# EAGLE design Lidar (EAGLE 9.6.2)

## Sheet 1 of 2
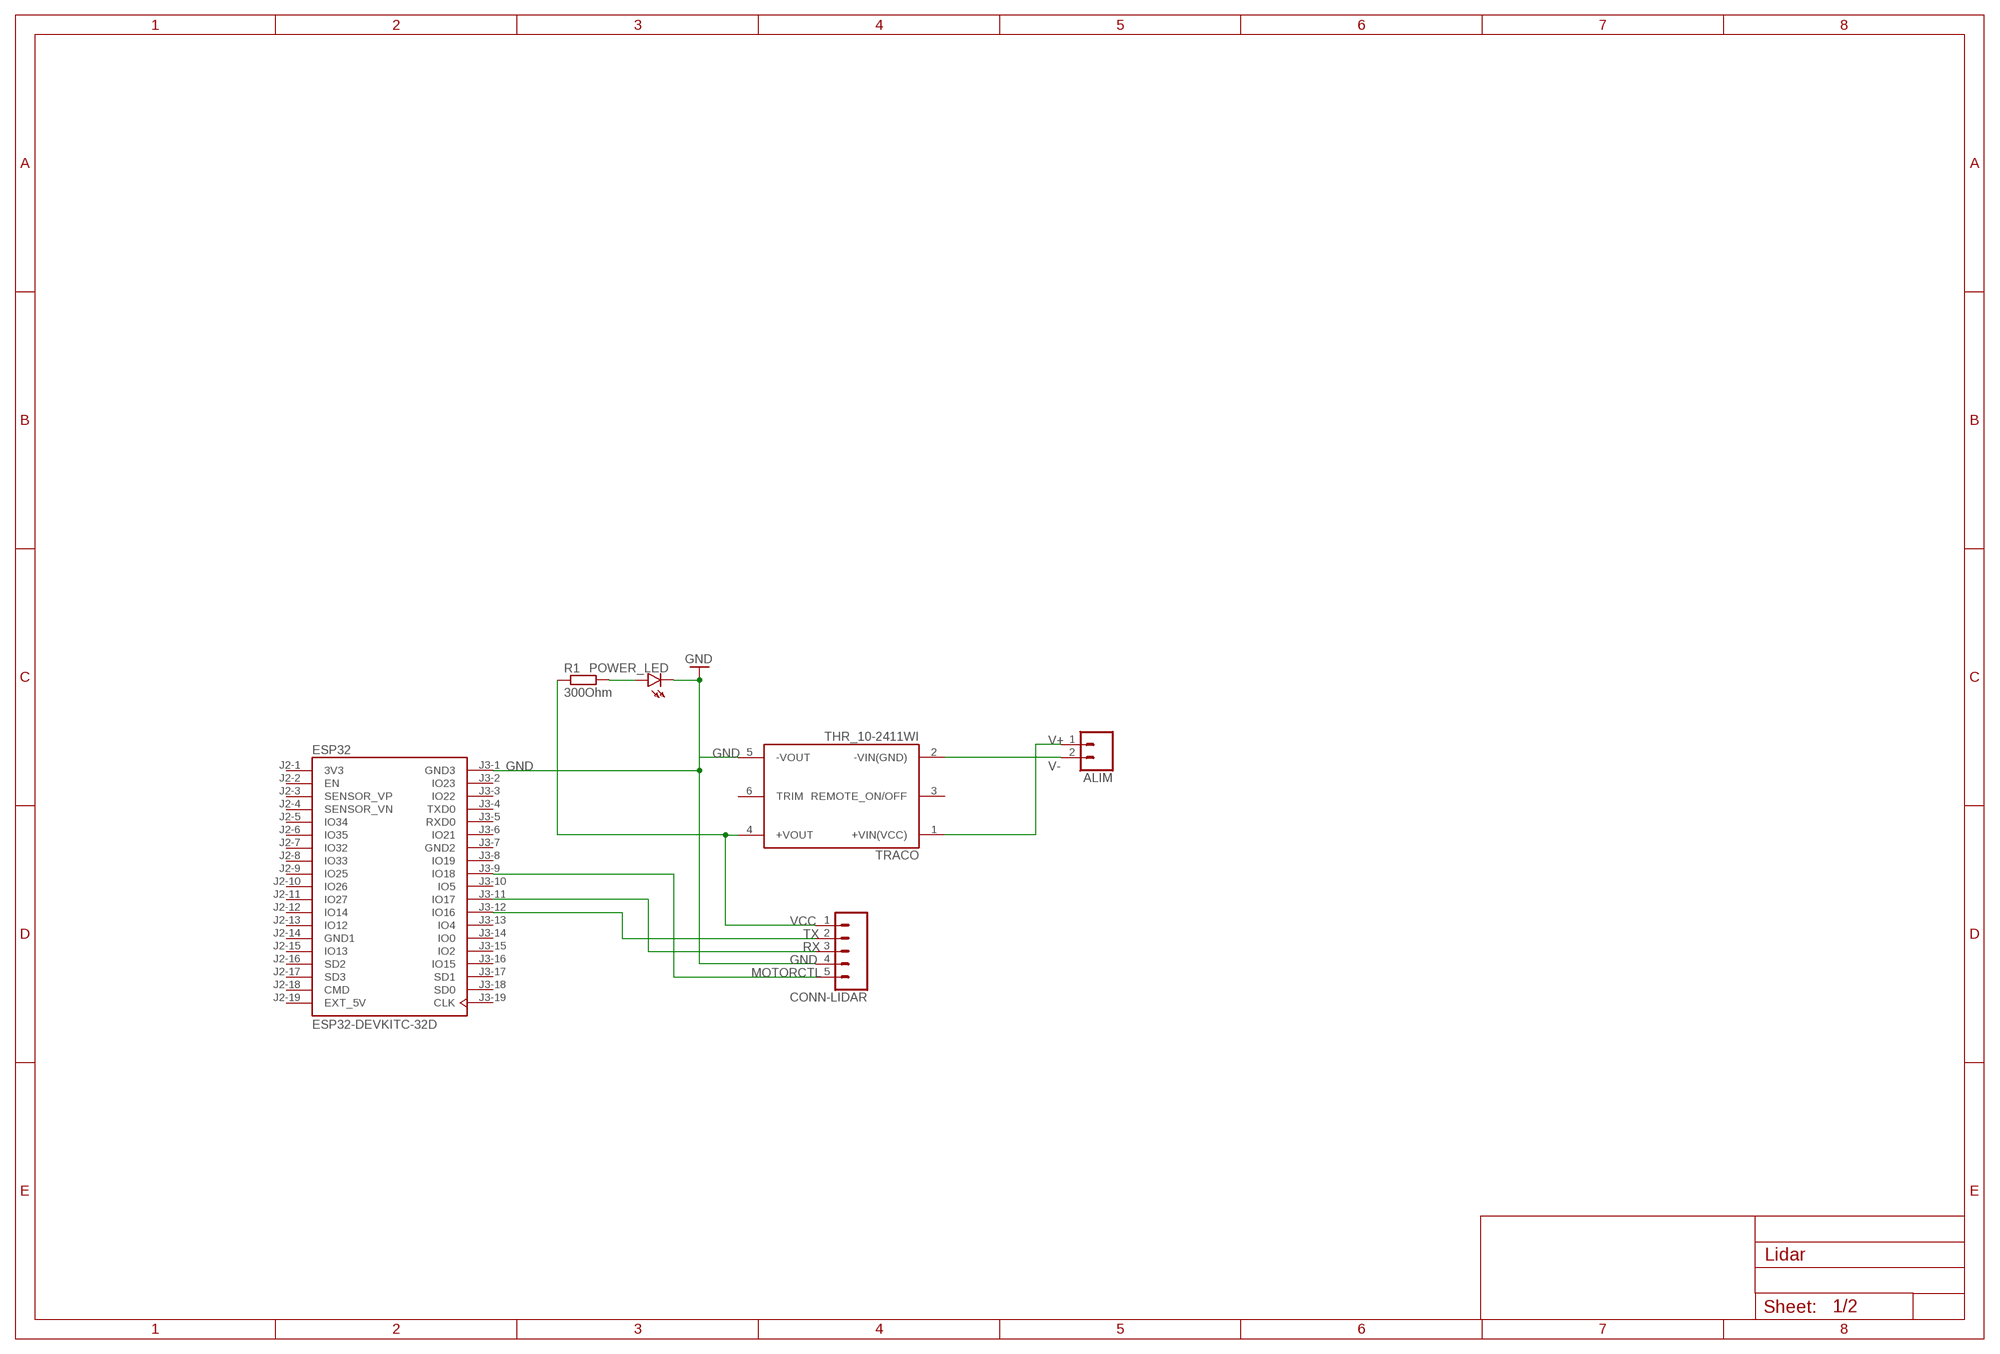
[diagram p0: schematic, sheet 1]

### Parts
ALIM  CONN_02POLAR  [MOLEX-1X2]
CONN-LIDAR  CONN_05PTH  [1X05]
ESP32  ESP32-DEVKITC-32D  [MODULE_ESP32-DEVKITC-32D]
POWER_LED  HLMP6  [HLMP6]
R1  300Ohm  R-EU_0411/15  [0411/15]
TRACO  THR_10-2411WI  [CONV_THR_10-2411WI]

### Nets
GND: CONN-LIDAR.4 ESP32.J3-1(GND3) POWER_LED.K TRACO.5(-VOUT)
MOTORCTL: CONN-LIDAR.5 ESP32.J3-9(IO18)
N$1: POWER_LED.A R1.2
RX: CONN-LIDAR.3 ESP32.J3-11(IO17)
TX: CONN-LIDAR.2 ESP32.J3-12(IO16)
V+: ALIM.1 TRACO.1(+VIN(VCC))
V-: ALIM.2 TRACO.2(-VIN(GND))
VCC: CONN-LIDAR.1 R1.1 TRACO.4(+VOUT)
Unconnected: ESP32.J2-2(EN) ESP32.J2-3(SENSOR_VP) ESP32.J2-4(SENSOR_VN) ESP32.J2-5(IO34) ESP32.J2-6(IO35) ESP32.J2-7(IO32) ESP32.J2-8(IO33) ESP32.J2-9(IO25) ESP32.J2-10(IO26) ESP32.J2-11(IO27) ESP32.J2-12(IO14) ESP32.J2-13(IO12) ESP32.J2-15(IO13) ESP32.J2-16(SD2) ESP32.J2-17(SD3) ESP32.J2-18(CMD) ESP32.J3-2(IO23) ESP32.J3-3(IO22) ESP32.J3-4(TXD0) ESP32.J3-5(RXD0) ESP32.J3-6(IO21) ESP32.J3-8(IO19) ESP32.J3-10(IO5) ESP32.J3-13(IO4) ESP32.J3-14(IO0) ESP32.J3-15(IO2) ESP32.J3-16(IO15) ESP32.J3-17(SD1) ESP32.J3-18(SD0) ESP32.J3-19(CLK) TRACO.3(REMOTE_ON/OFF) TRACO.6(TRIM)

## Sheet 2 of 2

## Power pins joined to a net without a drawn wire
3V3: ESP32.J2-1(3V3)
GND1: ESP32.J2-14(GND1)
GND2: ESP32.J3-7(GND2)
VCC: ESP32.J2-19(EXT_5V)

## Library data of the parts
ALIM = SparkFun-Connectors:CONN_02: Multi connection point. Often used as Generic Header-pin footprint for 0.1 inch spaced/style header connections On any of the 0.1 inch spaced packages, you can populate with these: Break Away Headers - Straight <https://www.sparkfun.com/products/116> (PRT-00116) Break Away Male Headers - Right Angle <https://www.sparkfun.com/products/553> (PRT-00553) Female Headers <https://www.sparkfun.com/products/115> (PRT-00115) Break Away Headers - Machine Pin <https://www.sparkfun.com/products/117> (PRT-00117) Break Away Female Headers - Swiss Machine Pin <https://www.sparkfun.com/products/743> (PRT-00743) For SCREWTERMINALS and SPRING TERMINALS visit here: Screw Terimnals on SparkFun.com <https://www.sparkfun.com/search/results?term=Screw+Terminals> (5mm/3.5mm/2.54mm spacing) This device is also useful as a general connection point to wire up your design to another part of your project. Our various solder wires solder well into these plated through hole pads. Hook-Up Wire - Assortment (Stranded, 22 AWG) <https://www.sparkfun.com/products/11375> (PRT-11375) Hook-Up Wire - Assortment (Solid Core, 22 AWG) <https://www.sparkfun.com/products/11367> (PRT-11367) View the entire wire category on our website here <https://www.sparkfun.com/categories/141> Special notes: Molex polarized connector foot print use with: PRT-08233 with associated crimp pins and housings. 2.54_SCREWTERM for use with PRT-10571. 3.5mm Screw Terminal footprints for PRT-08084 5mm Screw Terminal footprints for use with PRT-08432; SF_ID: PRT-09918
CONN-LIDAR = SparkFun-Connectors:CONN_05: Multi connection point. Often used as Generic Header-pin footprint for 0.1 inch spaced/style header connections On any of the 0.1 inch spaced packages, you can populate with these: Break Away Headers - Straight <https://www.sparkfun.com/products/116> (PRT-00116) Break Away Male Headers - Right Angle <https://www.sparkfun.com/products/553> (PRT-00553) Female Headers <https://www.sparkfun.com/products/115> (PRT-00115) Break Away Headers - Machine Pin <https://www.sparkfun.com/products/117> (PRT-00117) Break Away Female Headers - Swiss Machine Pin <https://www.sparkfun.com/products/743> (PRT-00743) For SCREWTERMINALS and SPRING TERMINALS visit here: Screw Terimnals on SparkFun.com <https://www.sparkfun.com/search/results?term=Screw+Terminals> (5mm/3.5mm/2.54mm spacing) This device is also useful as a general connection point to wire up your design to another part of your project. Our various solder wires solder well into these plated through hole pads. Hook-Up Wire - Assortment (Stranded, 22 AWG) <https://www.sparkfun.com/products/11375> (PRT-11375) Hook-Up Wire - Assortment (Solid Core, 22 AWG) <https://www.sparkfun.com/products/11367> (PRT-11367) View the entire wire category on our website here <https://www.sparkfun.com/categories/141> Special notes: Molex polarized connector foot print use with SKU : PRT-08231 with associated crimp pins and housings. 1MM SMD Version SKU: PRT-10208
ESP32 = ESP32-DEVKITC-32D:ESP32-DEVKITC-32D: Check availability <https://pricing.snapeda.com/parts/ESP32-DEVKITC-32D/Espressif%20Systems/view-part?ref=eda>; AVAILABILITY: In Stock; CHECK_PRICES: https://www.snapeda.com/parts/ESP32-DEVKITC-32D/Espressif+Systems/view-part/?ref=eda; DESCRIPTION: WiFi Development Tools (802.11) ESP32 General Development Kit, ESP32-WROOM-32D on the board; MF: Espressif Systems; MP: ESP32-DEVKITC-32D; PACKAGE: None; PRICE: None; PURCHASE-URL: https://www.snapeda.com/api/url_track_click_mouser/?unipart_id=2777395&manufacturer=Espressif Systems&part_name=ESP32-DEVKITC-32D&search_term=esp32-devkitc-32d; SNAPEDA_LINK: https://www.snapeda.com/parts/ESP32-DEVKITC-32D/Espressif+Systems/view-part/?ref=snap
POWER_LED = display-hp:HLMP6: LED 2mm horizontal; MF: AGILENT TECHNOLOGIES; MPN: HLMP-6500; OC_FARNELL: 1652490; OC_NEWARK: 40K0088
R1 = rcl:R-EU_: RESISTOR, European symbol; SPICEPREFIX: R
TRACO = THR_10-2411WI:THR_10-2411WI: 10 Watt DC/DC converter, industrial, 4:1 input, reinforced isolation (3000 VAC), encapsulated, 2"x1" Check availability <https://pricing.snapeda.com/parts/THR%2010-2411WI/Traco%20Power/view-part?ref=eda>; AVAILABILITY: In Stock; DESCRIPTION: 10 Watt DC/DC converter, industrial, 4:1 input, reinforced isolation (3000 VAC), encapsulated, 2x1; MF: Traco Power; MP: THR 10-2411WI; PACKAGE: DIP-6 Traco Power; PRICE: None; PURCHASE-URL: https://pricing.snapeda.com/search/part/THR 10-2411WI/?ref=eda

## Net classes
0 default: width 0.813 mm, drill 0.102 mm, clearance 0.102 mm

## Board
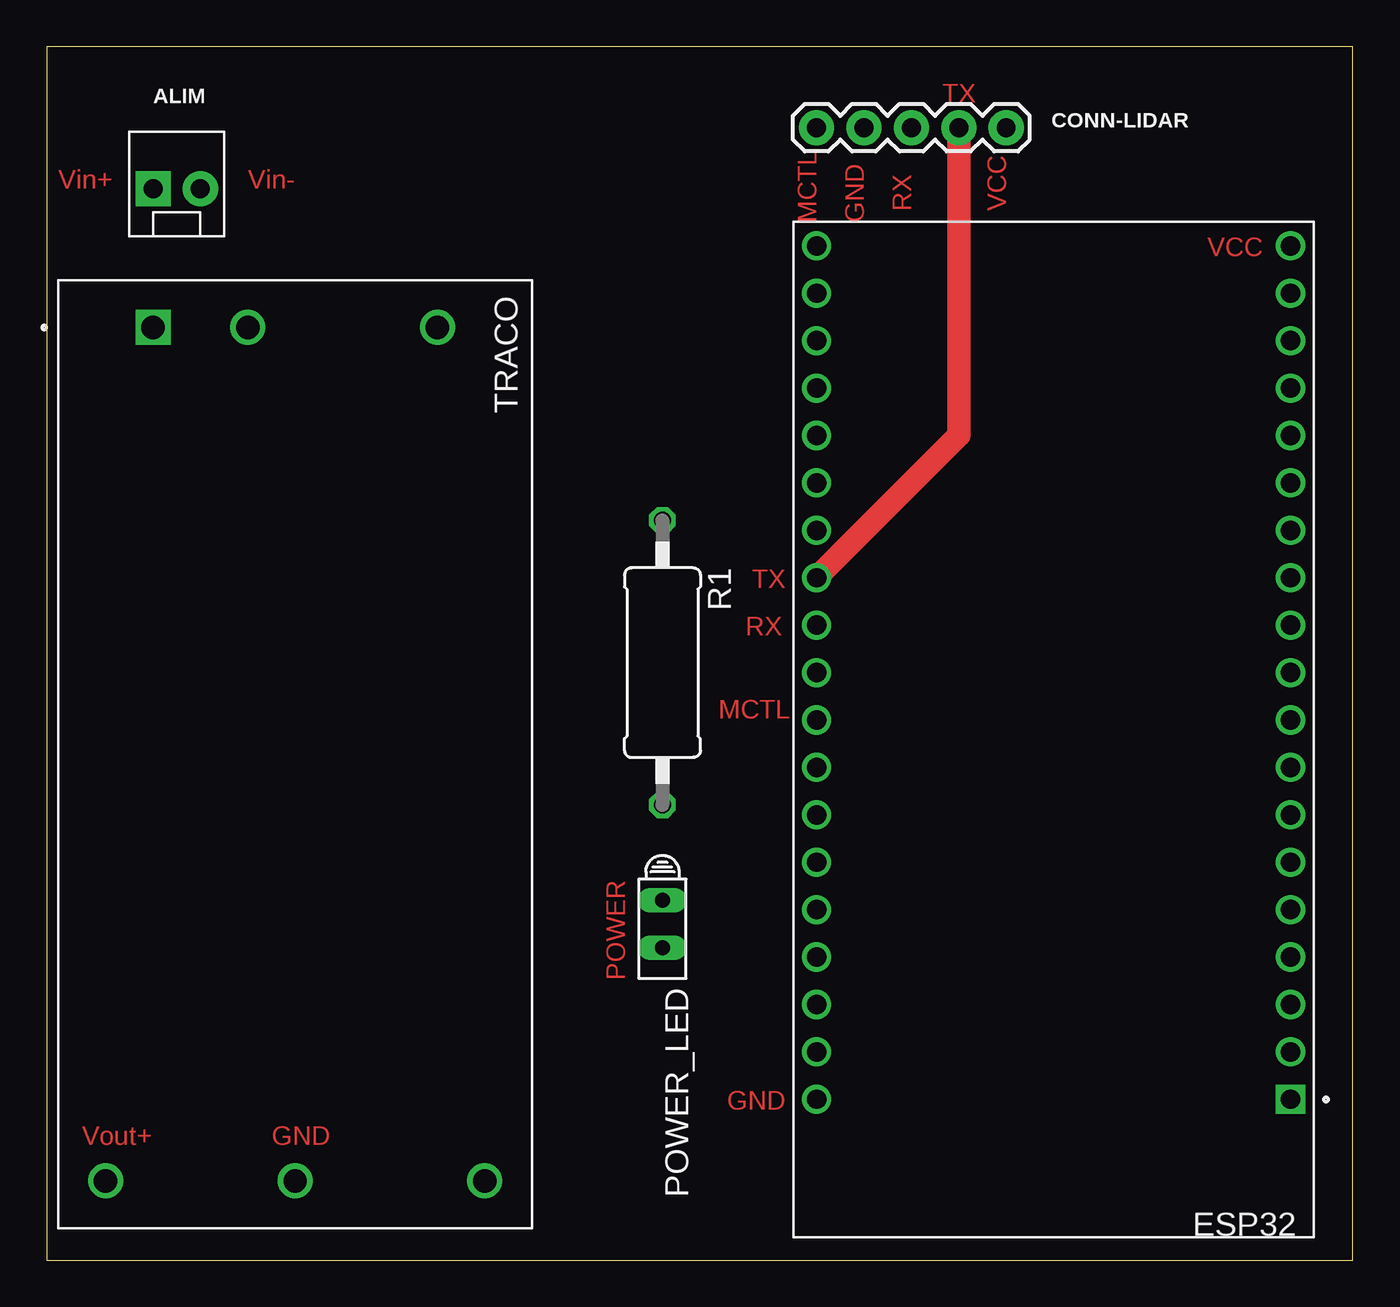
[diagram p1: board, top side]
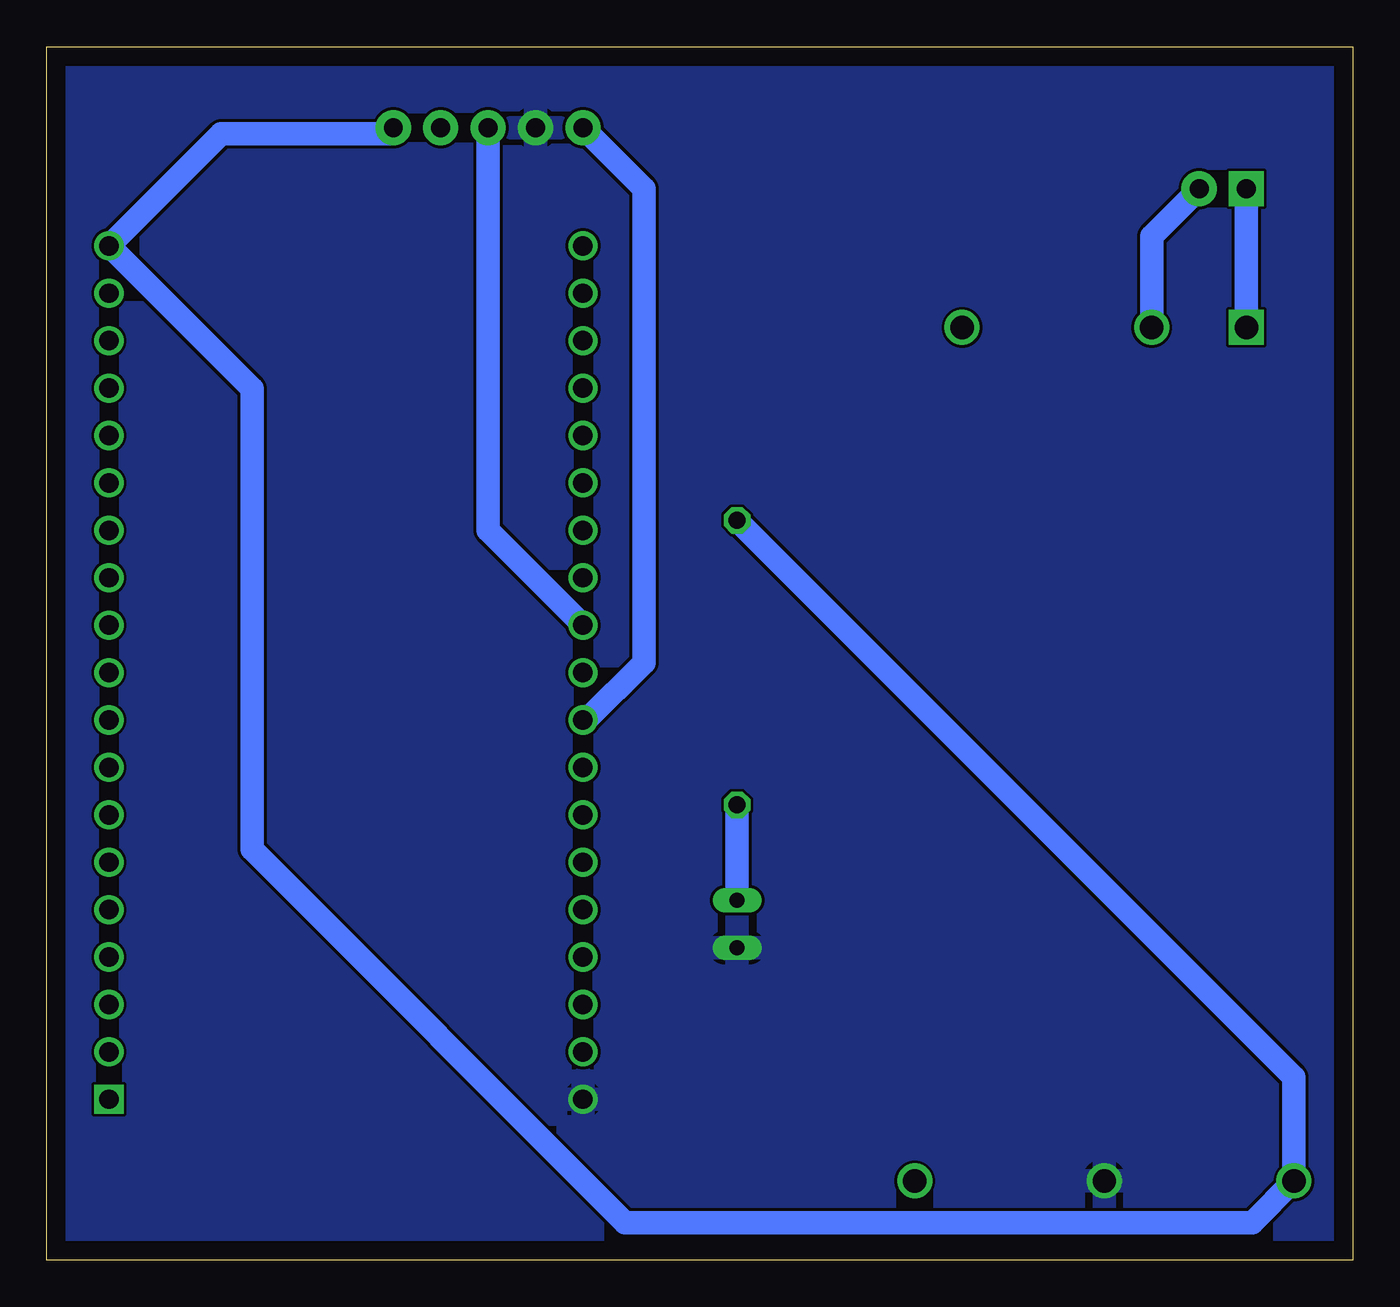
[diagram p2: board, bottom side, seen from below]

Size 70 x 65 mm. Coordinates in mm from the lower left corner, seen from the top.
Outline: 0,0 70,0 70,65 0,65 0,0
Copper layers (1*16): Top 0.1mm / dielectric 1.5mm / Bottom 0.1mm
Design rules "default *": minimum track width 6mil, minimum drill 0.35mm, track to track 6mil, track to pad 6mil, pad to pad 6mil, via to via 6mil, smd to smd 6mil, copper to edge 40mil, drill to drill 6mil, minimum pad ring 10mil, minimum via ring 8mil, stop-mask expansion 4mil, vias tented up to drill 0mil, thermal gap 10mil

### Footprints (pad centres in the part's own frame; a part is rotated, then mirrored left to right if it is on the bottom)
MOLEX-1X2 = drill 1.016 pad 1.88 square: 1 0,0 | drill 1.016 pad 1.88: 2 2.54,0
1X05 = drill 1.016 pad 1.88: 1 0,0; 2 2.54,0; 3 5.08,0; 4 7.62,0; 5 10.16,0
MODULE_ESP32-DEVKITC-32D = drill 1.04 square: J2-1 -12.7,19.76 | drill 1.04: J2-2 -12.7,17.22; J2-3 -12.7,14.68; J2-4 -12.7,12.14; J2-5 -12.7,9.6; J2-6 -12.7,7.06; J2-7 -12.7,4.52; J2-8 -12.7,1.98; J2-9 -12.7,-0.56; J2-10 -12.7,-3.1; J2-11 -12.7,-5.64; J2-12 -12.7,-8.18; J2-13 -12.7,-10.72; J2-14 -12.7,-13.26; J2-15 -12.7,-15.8; J2-16 -12.7,-18.34; J2-17 -12.7,-20.88; J2-18 -12.7,-23.42; J2-19 -12.7,-25.96; J3-1 12.7,19.76; J3-2 12.7,17.22; J3-3 12.7,14.68; J3-4 12.7,12.14; J3-5 12.7,9.6; J3-6 12.7,7.06; J3-7 12.7,4.52; J3-8 12.7,1.98; J3-9 12.7,-0.56; J3-10 12.7,-3.1; J3-11 12.7,-5.64; J3-12 12.7,-8.18; J3-13 12.7,-10.72; J3-14 12.7,-13.26; J3-15 12.7,-15.8; J3-16 12.7,-18.34; J3-17 12.7,-20.88; J3-18 12.7,-23.42; J3-19 12.7,-25.96
HLMP6 = drill 0.813 long: A -1.27,0; K 1.27,0
0411/15 = drill 0.914 octagon: 1 -7.62,0; 2 7.62,0
CONV_THR_10-2411WI = drill 1.25 square: 1 -7.62,22.86 | drill 1.25: 2 -2.54,22.86; 3 7.62,22.86; 4 -10.16,-22.86; 5 0,-22.86; 6 10.16,-22.86

### Placement (x,y rotation side)
ALIM  5.7,57.39 0 top
CONN-LIDAR  51.42,60.66 180 top
ESP32  53.96,28.37 180 top
POWER_LED  33,18 270 top
R1  33,32 270 top
TRACO  13.32,27.1 0 top

### Tracks (layer width: path | path; a pad name or v marks a point on that pad's centre or on a via)
GND
  pour Bottom: 0,65 70,65 70,0 0,0
MOTORCTL
  Bottom 1.27: CONN-LIDAR.5 38,57.4 38,32 41.07,28.93 ESP32.J3-9
N$1
  Bottom 1.27: R1.2 POWER_LED.A
RX
  Bottom 1.27: ESP32.J3-11 46.34,39.09 CONN-LIDAR.3
TX
  Top 1.27: ESP32.J3-12 48.88,44.17 CONN-LIDAR.2
V+
  Bottom 1.27: ALIM.1 TRACO.1
V-
  Bottom 1.27: ALIM.2 10.78,54.85 TRACO.2
VCC
  Bottom 1.27: CONN-LIDAR.1 51.42,60.57 51.66,60.33 60.66,60.33 ESP32.J2-19 59,46.67 59,22 39,2 5.4,2 TRACO.4 3.16,9.78 R1.1

### Text on the board
Top: TX | Vin+ | Vin- | MCTL | GND | RX | VCC | VCC | TX | RX | MCTL | POWER | GND | Vout+ | GND